# EAGLE design Rev1 (EAGLE 6.5.0)
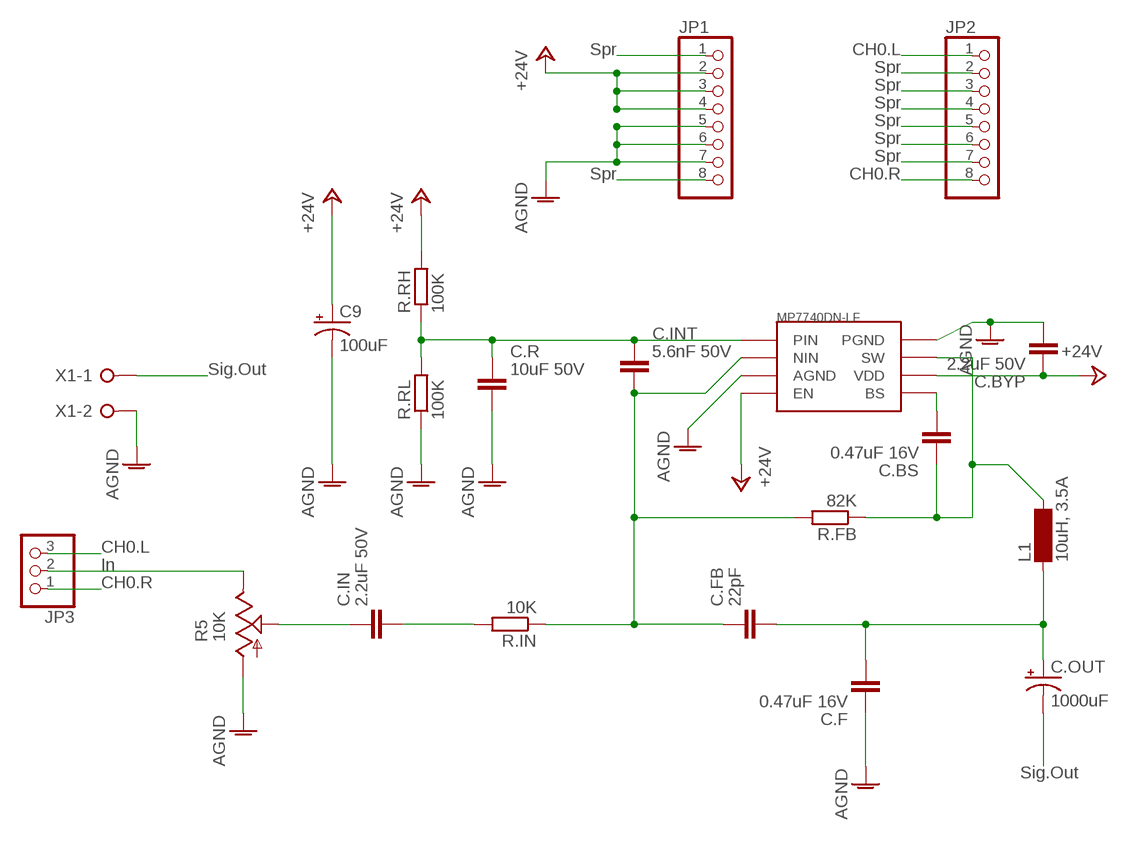
[diagram p0: schematic, sheet 1]

## Parts
C9  100uF  CPOL-USE5-4  [E5-4]
C.BS  0.47uF 16V  CAPACITOR_NPOL-0805  [C805]
C.BYP  2.2uF 50V  CAPACITOR_NPOL-0805  [C805]
C.F  0.47uF 16V  CAPACITOR_NPOL-0805  [C805]
C.FB  22pF  CAPACITOR_NPOL-0603  [C603]
C.IN  2.2uF 50V  CAPACITOR_NPOL-0805  [C805]
C.INT  5.6nF 50V  CAPACITOR_NPOL-0603  [C603]
C.OUT  1000uF  CPOL-USE5-4  [E5-4]
C.R  10uF 50V  CAPACITOR_NPOL-1206  [C1206]
JP1  PINHD-1X8  [1X08]
JP2  PINHD-1X8  [1X08]
JP3  PINHD-1X3  [1X03]
L1  10uH, 3.5A  BS11  [BS11]
R5  10K  TRIM_US-PT-10S  [PT-10S]
R.FB  82K  RESISTORR805-0805  [R805]
R.IN  10K  RESISTORR805-0805  [R805]
R.RH  100K  RESISTOR-0603  [R603]
R.RL  100K  RESISTOR-0603  [R603]
U$1  MP7740DN-LF  [SOIC8]
X1  W237-02P  [W237-132]

## Nets
+24V: C9.+ C.BYP.1 JP1.2 JP1.3 JP1.4 R.RH.2 U$1.4(EN) U$1.6(VDD)
AGND: C9.- C.BYP.2 C.F.1 C.R.2 JP1.5 JP1.6 JP1.7 R5.A R.RL.1 U$1.3(AGND) U$1.8(PGND) X1.2
CH0.L: JP2.1 JP3.3
CH0.R: JP2.8 JP3.1
JP1-P1: JP1.1
JP1-P2: JP1.8
JP2-P2: JP2.2
JP2-P3: JP2.3
JP2-P4: JP2.4
JP2-P5: JP2.5
JP2-P6: JP2.6
JP2-P7: JP2.7
N$1: C.INT.1 C.R.1 R.RH.1 R.RL.2 U$1.1(PIN)
N$2: C.FB.1 C.INT.2 R.FB.2 R.IN.1 U$1.2(NIN)
N$3: C.IN.2 R.IN.2
N$5: C.BS.2 U$1.5(BS)
N$6: C.BS.1 L1.2 R.FB.1 U$1.7(SW)
N$7: JP3.2 R5.E
N$8: C.IN.1 R5.S
N$9: C.F.2 C.FB.2 C.OUT.+ L1.1
SIGOUT: C.OUT.- X1.1

## Notes on the sheet
- Spr | CH0.L
- Spr
- Spr
- Spr
- Spr
- Spr
- Spr
- Spr | CH0.R
- Sig.Out
- CH0.L
- In
- CH0.R
- Sig.Out

## Library data of the parts
C9 C.OUT = resistor:CPOL-US: POLARIZED CAPACITOR, American symbol
C.BS C.BYP C.F C.FB C.IN C.INT C.R = dp_devices.v6:CAPACITOR_NPOL: Non-Polarized capacitor in various packages
JP1 JP2 = pinhead+:PINHD-1X8: PIN HEADER
JP3 = pinhead:PINHD-1X3: PIN HEADER
L1 = inductor-neosid:BS: INDUCTOR nominal inductance, magnetically screened; OC_FARNELL: unknown; OC_NEWARK: unknown
R5 = pot:TRIM_US-: POTENTIOMETER
R.FB R.IN R.RH R.RL = dp_devices.v6:RESISTOR
U$1 = .Custom_Walker:MP7740DN-LF
X1 = con-wago-508:W237-02P: WAGO SREW CLAMP; OC_FARNELL: unknown; OC_NEWARK: unknown

## Board
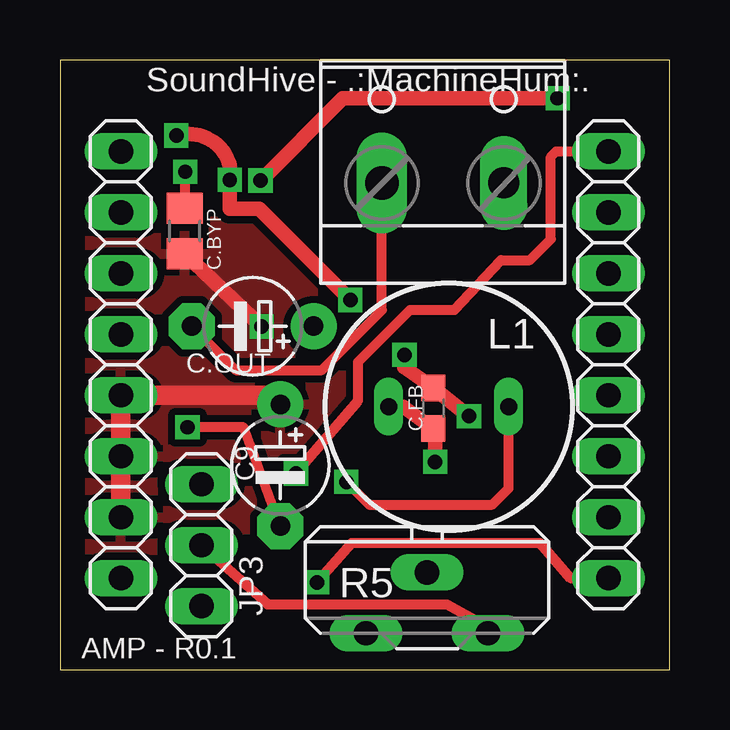
[diagram p1: board, top side]
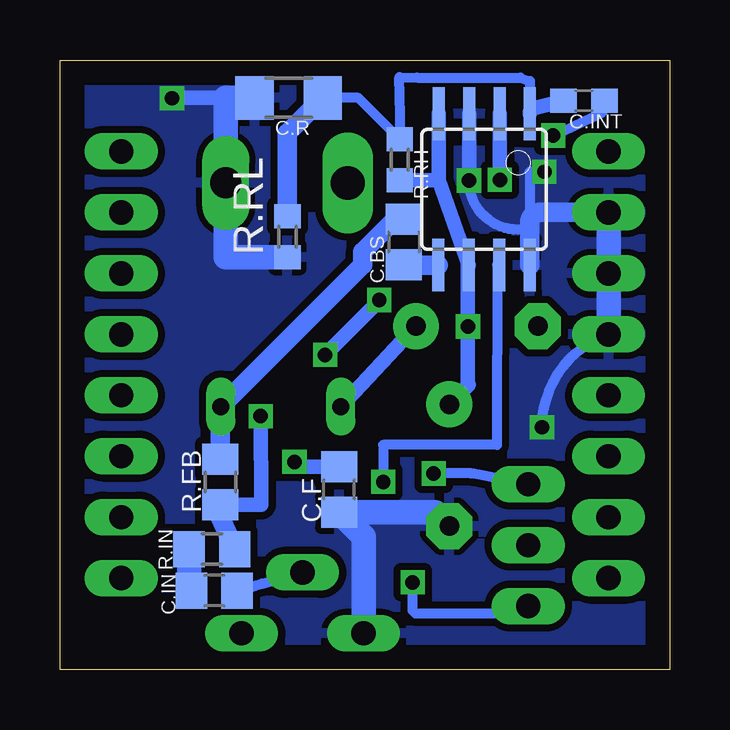
[diagram p2: board, bottom side, seen from below]

Size 25.4 x 25.4 mm. Coordinates in mm from the lower left corner, seen from the top.
Outline: 0,0 25.4,0 25.4,25.4 0,25.4 0,0
Copper layers (1*16): Top 0.035mm / dielectric 1.5mm / Bottom 0.035mm
Design rules "default": minimum track width 10mil, minimum drill 24mil, track to track 8mil, track to pad 8mil, pad to pad 8mil, via to via 8mil, smd to smd 8mil, copper to edge 40mil, drill to drill 8mil, minimum pad ring 10mil, minimum via ring 8mil, stop-mask expansion 4mil, vias tented up to drill 0mil, thermal gap 10mil

### Footprints (pad centres in the part's own frame; a part is rotated, then mirrored left to right if it is on the bottom)
E5-4 = drill 0.813 pad 1.905: + -2.54,0 | drill 0.813 pad 1.905 octagon: - 2.54,0
C805 = smd 1.3 x 1.5: 1 -0.95,0; 2 0.95,0
C603 = smd 1.1 x 1: 1 -0.85,0; 2 0.85,0
C1206 = smd 1.6 x 1.803: 1 -1.422,0; 2 1.422,0
1X08 = drill 1.016 long: 1 -8.89,0; 2 -6.35,0; 3 -3.81,0; 4 -1.27,0; 5 1.27,0; 6 3.81,0; 7 6.35,0; 8 8.89,0
1X03 = drill 1.016 long: 1 -2.54,0; 2 0,0; 3 2.54,0
BS11 = drill 0.7 long: 1 -2.5,0; 2 2.5,0
PT-10S = drill 1.016 long: A -2.54,-1.27; E 2.54,-1.27; S 0,1.27
R805 = smd 1.3 x 1.5: 1 -0.95,0; 2 0.95,0
R603 = smd 1 x 1.1: 1 -0.85,0; 2 0.85,0
SOIC8 = smd 0.5 x 2.2: 1 -1.905,-3.154; 2 -0.645,-3.154; 3 0.625,-3.154; 4 1.895,-3.154; 5 1.905,3.154; 6 0.635,3.154; 7 -0.635,3.154; 8 -1.905,3.154
W237-132 = drill 1.4 long: 1 -2.54,-0.635 | drill 1.3 long: 2 2.54,-0.635

### Placement (x,y rotation side)
C9  9.18,8.51 270 top
C.BS  11.08,17.82 270 bottom
C.BYP  5.2,18.28 90 top
C.F  13.77,7.51 90 bottom
C.FB  15.55,10.89 270 top
C.IN  18.97,3.29 180 bottom
C.INT  3.57,23.69 0 bottom
C.OUT  8.03,14.31 180 top
C.R  15.87,23.82 180 bottom
JP1  2.54,12.7 90 top
JP2  22.85,12.7 90 top
JP3  5.89,5.18 270 top
L1  16.2,10.95 0 top
R5  15.29,2.78 0 top
R.FB  18.71,7.82 270 bottom
R.IN  19.07,5.02 180 bottom
R.RH  11.24,21.25 270 bottom
R.RL  15.92,18.04 90 bottom
U$1  7.73,20.01 180 bottom
X1  15.95,20.92 0 top

### Tracks (layer width: path | path; a pad name or v marks a point on that pad's centre or on a via)
+24V  (via drill 0.6)
  Top 0.61: 8.8,11.43 C9.+ | C.BYP.1 v8.4,14.29
  Top 0.813: JP1.2 JP1.3 JP1.4 8.8,11.43
  Bottom 0.406: 8.4,16.82 arc90 U$1.6 | 8.4,11.9 arc-90 8.37,11.87
  Bottom 0.61: 8.37,11.87 C9.+ | U$1.4 9.63,20.4 | 9.63,20.4 R.RH.2 | U$1.6 9.63,20.4 | 8.4,16.82 v8.4,14.29 8.4,11.9
  pour Top (isolate 0.305): 0,0 0,25.4 25.4,25.4 25.4,0
AGND  (via drill 0.6)
  Top 0.406: C9.- 7.65,10.09 v5.32,10.1 | C.BYP.2 5.22,19.23 v5.22,20.75
  Top 0.61: v20.73,23.81 11.78,23.81 v8.36,20.38
  Bottom 0.406: v5.32,10.1 arc71 JP1.5 | v5.22,20.75 5.83,20.75 | 5.83,20.75 5.83,18.61 | 5.83,20.75 5.83,20.74 5.83,18.33 6.31,18.33 arc90 v8.36,20.38
  Bottom 0.61: C.R.2 v20.72,23.82 v20.73,23.81 | v8.36,20.38 U$1.3 | U$1.3
  Bottom 0.813: U$1.8 5.83,18.61 arc90 5.38,19.05 JP1.7
  Bottom 1.016: C.R.2 18.49,23.82 X1.2 18.49,17.19 R.RL.1 | JP1.7 JP1.6 JP1.5 | R5.A 12.75,5.54 C.F.1 9.76,6.56 C9.-
  pour Bottom (isolate 0.305): 0,0 0,25.4 25.4,25.4 25.4,0
CH0.L  (via drill 0.6)
  Top 0.406: v10.71,3.64 12.15,5.28 19.99,5.28 21.26,3.81 JP2.1
  Bottom 0.406: JP3.3 6.85,2.34 10.59,2.34 10.71,2.46 v10.71,3.64
CH0.R  (via drill 0.6)
  Top 0.406: v9.83,8.17 12.43,11.21 12.43,12.82 14.59,14.98 16.43,14.98 18.38,17.06 19.57,17.06 20.45,17.94 20.45,21.37 20.68,21.59 JP2.8
  Bottom 0.406: JP3.1 8.27,8.17 v9.83,8.17
N$1
  Bottom 0.406: C.R.1 12.96,23.82 R.RH.1 11.23,23.12 11.26,24.69 10.52,24.67 6.21,24.67 5.83,24.52 U$1.1
  Bottom 0.61: C.INT.1 5.59,23.4 arc-90 U$1.1
  Bottom 0.813: C.R.1 15.92,22.35 R.RL.2
N$2  (via drill 0.6)
  Top 0.61: v4.85,22.25 arc-90 7.07,21.03 v7.07,20.41 7.07,19.2 8.3,19.2 v12.1,15.4 | v17.04,10.56 C.FB.1 14.35,12.6 v14.35,13.11
  Bottom 0.406: v4.85,22.25 2.79,23.23 2.78,23.7 C.INT.2
  Bottom 0.61: U$1.2 7.09,20.41 v7.07,20.41 | v17.04,10.56 17.02,6.86 R.FB.2 | v14.35,13.11 12.1,15.37 v12.1,15.4
  Bottom 0.813: R.FB.2 18.73,6.39 R.IN.1
N$3
  Bottom 0.406: C.IN.2 20.02,3.37
  Bottom 1.016: 20.02,3.37 R.IN.2
N$5
  Bottom 0.406: C.BS.2 11.06,16.86
  Bottom 0.813: 11.06,16.86 U$1.5
N$6  (via drill 0.6)
  Top 0.406: L1.2 18.7,7.56 18.02,6.87 12.88,6.87 v11.93,7.82
  Bottom 0.406: U$1.7 7.19,16.86 7.2,9.37 11.94,9.37 v11.93,7.82
  Bottom 0.813: C.BS.1 11.44,18.77 12.78,17.42 12.78,16.87 L1.2 18.71,10.94 R.FB.1
N$7
  Top 0.406: JP3.2 8.65,2.72 16.12,2.72 17.46,1.98 R5.E
N$8
  Bottom 0.406: C.IN.1 17.24,3.49 17.08,3.55 16.98,3.58 R5.S
N$9  (via drill 0.6)
  Top 0.61: L1.1 14.3,10.95 C.FB.2 15.63,9.62 v15.63,8.66
  Bottom 0.61: L1.1 C.OUT.+ | v15.63,8.66 15.35,8.46 C.F.2
SIGOUT
  Top 0.406: C.OUT.- 7.32,12.47 10.91,12.47 13.41,14.98 X1.1

### Text on the board
tPlace: SoundHive - .:MachineHum:. | AMP - R0.1